# Altium schematic sheet Battery.SchDoc: =GlobalProjectName
size 209 x 297 mm; ApprovedBy: Утвердил; CheckedBy: Проверил; Author: Разработал; SheetNumber: 2; SheetTotal: 7; PageSetup: Record=PageOptions|CenterHorizontal=True|CenterVertical=True|PrintScale=1.00|XCorrection=1.00|YCorrection=1.00|PrintKind=1|BorderSize=5000000|LeftOffset=0|BottomOffset=0|Orientation=2|PaperLength=1000|PaperWidth=1000|Scale=100|PaperSource=15|PrintQuality=1200|MediaType=1|DitherType=10|PaperKind=A3|PrintScaleMode=1; Weight: -; ScaleFactor: -; NormInspection: Норм.Контр.
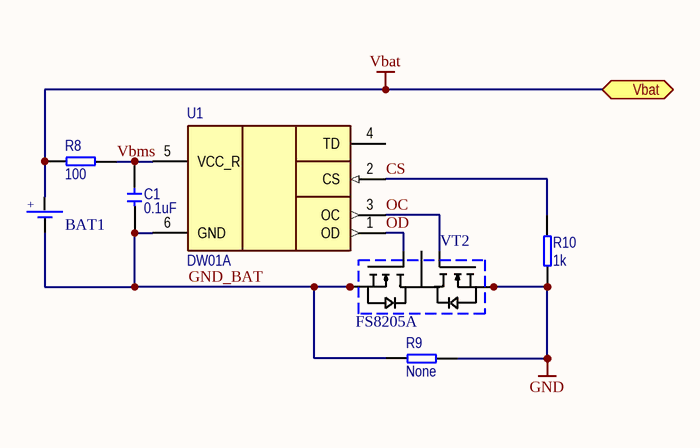
[diagram p0: Battery.SchDoc]

## Parts
BAT1  18350+clipses  [BAT_18350_CLIPS]  (value not drawn)
C1  value 0.1uF  [CERCAP 0402]
R8  value 100  [RES 0402]
R9  value None  [RES 0603]  (no BOM)
R10  value 1k  [RES 0402]
U1  DW01A  [SOT23-6]
VT2  FS8205A  [TSSOP-8]

## Ports
Vbat (bidir)

## Nets
GND: R9.1 R10.1 VT2.6 VT2.7
Vbat: BAT1.A R8.1 ; port Vbat
CS: R10.2 U1.2(CS)
GND_BAT: BAT1.K C1.1 R9.2 U1.6(GND) VT2.2 VT2.3
OC: U1.3(OC) VT2.5
OD: U1.1(OD) VT2.4
Vbms: C1.2 R8.2 U1.5(VCC_R)
NetVT2_1: VT2.1 VT2.8

Not connected (* = marked no-connect by the designer): U1 4(TD)

## Notes on the sheet
- Подп. и дата
- Инв. № дубл.
- Взам. инв. №
- Инв. № подл.
- Изм.
- Лист
- № докум.
- Подп.
- Дата
- Форма 2а ГОСТ 2.104-2006
- Копировал
- Формат А4
- (in symbol !Battery) +

## Library data of the parts
BAT1 = !Battery: generic battery
C1 = !Capacitor: Capacitor; IsSMT: NoSMT; Voltage: 10V; Diel: X7R
R8-R10 = !Resistor: Resistor; IsSMT: NoSMT
U1 = DW01A: BMS
VT2 = FS8205A: double N-ch; IsSMT: NoSMT